# EAGLE schematic smart-tps (EAGLE 9.6.2)
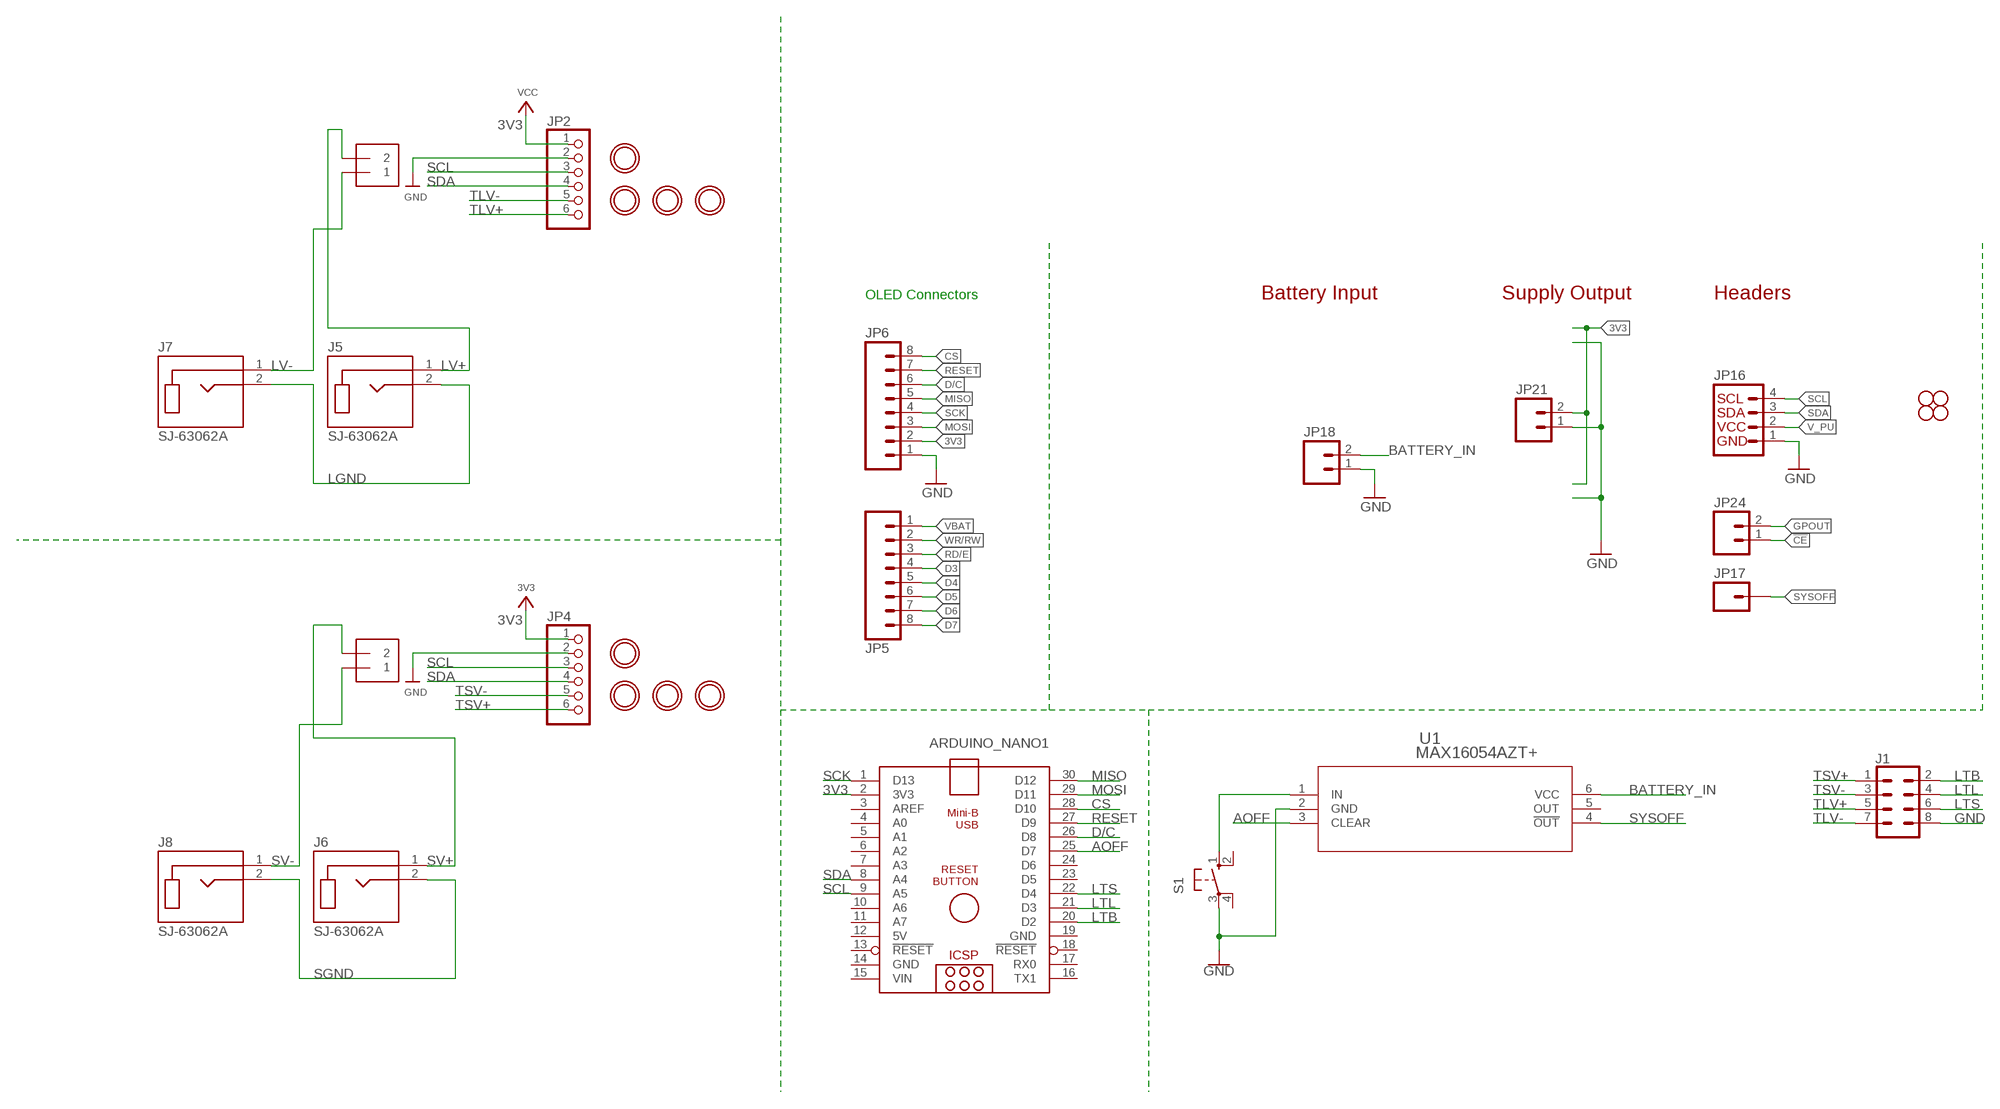
[diagram p0: schematic, sheet 1]

## Parts
ARDUINO_NANO1  ARDUINO_NANO  [ARDUINO_NANO]
J1  CONN_04X2  [2X4]
J2  TERMBLOCK_1X2-3.5MM  [1X2-3.5MM]
J4  TERMBLOCK_1X2-3.5MM  [1X2-3.5MM]
J5  SJ-63062A  [CUI_SJ-63062A]
J6  SJ-63062A  [CUI_SJ-63062A]
J7  SJ-63062A  [CUI_SJ-63062A]
J8  SJ-63062A  [CUI_SJ-63062A]
JP2  HEADER-1X670MIL  [1X06_ROUND_70]
JP4  HEADER-1X670MIL  [1X06_ROUND_70]
JP5  M08  [1X08_PIN1_NO_SILK]
JP6  M08  [1X08_PIN1_NO_SILK]
JP16  I2C_STANDARD_NO_SILK  [1X04_NO_SILK]
JP17  M01PTH_NO_SILK_YES_STOP  [1X01_NO_SILK]
JP18  M021X02_NO_SILK  [1X02_NO_SILK@1]
JP21  M021X02_NO_SILK  [1X02_NO_SILK@1]
JP24  M021X02_NO_SILK  [1X02_NO_SILK@1]
S1  10-XX  [B3F-10XX]
STANDOFF5  STAND-OFF  [STAND-OFF]
STANDOFF6  STAND-OFF  [STAND-OFF]
STANDOFF7  STAND-OFF  [STAND-OFF]
STANDOFF8  STAND-OFF  [STAND-OFF]
U1  MAX16054AZT+  [21-0114C_MXM]
U$18  MOUNTINGHOLE2.5  [MOUNTINGHOLE_2.5_PLATED]
U$19  MOUNTINGHOLE2.5  [MOUNTINGHOLE_2.5_PLATED]
U$20  MOUNTINGHOLE2.5  [MOUNTINGHOLE_2.5_PLATED]
U$21  MOUNTINGHOLE2.5  [MOUNTINGHOLE_2.5_PLATED]
U$40  MOUNTINGHOLE2.5  [MOUNTINGHOLE_2.5_PLATED]
U$41  MOUNTINGHOLE2.5  [MOUNTINGHOLE_2.5_PLATED]
U$42  MOUNTINGHOLE2.5  [MOUNTINGHOLE_2.5_PLATED]
U$43  MOUNTINGHOLE2.5  [MOUNTINGHOLE_2.5_PLATED]

## Nets
3V3 [power_supply]: ARDUINO_NANO1.2(3V3) JP2.1 JP4.1 JP6.2 JP21.2 ; supply symbol labelled VCC
!CE!: JP24.1
AOFF: ARDUINO_NANO1.25(D7) U1.3(CLEAR)
BATTERY_IN: JP18.2 U1.6(VCC)
CS: ARDUINO_NANO1.28(D10) JP6.8
D3: JP5.4
D4: JP5.5
D5: JP5.6
D6: JP5.7
D7: JP5.8
D/C: ARDUINO_NANO1.26(D8) JP6.6
GND: J1.8 JP2.2 JP4.2 JP6.1 JP16.1 JP18.1 JP21.1 S1.3(P) U1.2(GND)
GPOUT: JP24.2
LGND [tool_power]: J5.2(TIP) J7.2(TIP)
LTB: ARDUINO_NANO1.20(D2) J1.2
LTL: ARDUINO_NANO1.21(D3) J1.4
LTS: ARDUINO_NANO1.22(D4) J1.6
LV+ [tool_power]: J2.2 J5.1(SLEEVE)
LV- [tool_power]: J2.1 J7.1(SLEEVE)
MISO: ARDUINO_NANO1.30(D12) JP6.5
MOSI: ARDUINO_NANO1.29(D11) JP6.3
N$4: S1.1(S) U1.1(IN)
RD/E: JP5.3
RESET: ARDUINO_NANO1.27(D9) JP6.7
SCK: ARDUINO_NANO1.1(D13) JP6.4
SCL: ARDUINO_NANO1.9(A5) JP2.3 JP4.3 JP16.4
SDA: ARDUINO_NANO1.8(A4) JP2.4 JP4.4 JP16.3
SGND [tool_power]: J6.2(TIP) J8.2(TIP)
SV+ [tool_power]: J4.2 J6.1(SLEEVE)
SV- [tool_power]: J4.1 J8.1(SLEEVE)
SYSOFF: JP17.1 U1.4(!OUT)
TLV+: J1.5 JP2.6
TLV-: J1.7 JP2.5
TSV+: J1.1 JP4.6
TSV-: J1.3 JP4.5
V_PU: JP16.2
VBAT: JP5.1
WR/RW: JP5.2
Unconnected: ARDUINO_NANO1.3(AREF) ARDUINO_NANO1.4(A0) ARDUINO_NANO1.5(A1) ARDUINO_NANO1.6(A2) ARDUINO_NANO1.7(A3) ARDUINO_NANO1.10(A6) ARDUINO_NANO1.11(A7) ARDUINO_NANO1.13(!RESET) ARDUINO_NANO1.16(TX1) ARDUINO_NANO1.17(RX0) ARDUINO_NANO1.18(!RESET) ARDUINO_NANO1.23(D5) ARDUINO_NANO1.24(D6) S1.2(S1) S1.4(P1) U1.5(OUT)

## Notes on the sheet
- Battery Input | Supply Output | Headers
- OLED Connectors

## Power pins joined to a net without a drawn wire
5V: ARDUINO_NANO1.12(5V)
GND: ARDUINO_NANO1.14(GND) ARDUINO_NANO1.19(GND)
VIN: ARDUINO_NANO1.15(VIN)

## Library data of the parts
ARDUINO_NANO1 = ArduinoNanoV30:ARDUINO_NANO: Arduino Nano V3.0 Overview: The Arduino Nano is a small, complete, and breadboard-friendly board based on the ATmega328 (Arduino Nano 3.x) or ATmega168 (Arduino Nano 2.x). It has more or less the same functionality of the Arduino Duemilanove, but in a different package. It lacks only a DC power jack, and works with a Mini-B USB cable instead of a standard one. The Nano was designed and is being produced by Gravitech. Specifications: Microcontroller Atmel ATmega168 or ATmega328 Operating Voltage (logic level) 5 V Input Voltage (recommended) 7-12 V Input Voltage (limits) 6-20 V Digital I/O Pins 14 (of which 6 provide PWM output) Analog Input Pins 8 DC Current per I/O Pin 40 mA Flash Memory 16 KB (ATmega168) or 32 KB (ATmega328) of which 2 KB used by bootloader SRAM 1 KB (ATmega168) or 2 KB (ATmega328) EEPROM 512 bytes (ATmega168) or 1 KB (ATmega328) Clock Speed 16 MHz Dimensions 0.73" x 1.70" Length 45 mm Width 18 mm Weigth 5 g Power: The Arduino Nano can be powered via the Mini-B USB connection, 6-20V unregulated external power supply (pin 30), or 5V regulated external power supply (pin 27). The power source is automatically selected to the highest voltage source. Memory: The ATmega168 has 16 KB of flash memory for storing code (of which 2 KB is used for the bootloader); the ATmega328 has 32 KB, (also with 2 KB used for the bootloader). The ATmega168 has 1 KB of SRAM and 512 bytes of EEPROM (which can be read and written with the EEPROM library); the ATmega328 has 2 KB of SRAM and 1 KB of EEPROM. Input and Output: Each of the 14 digital pins on the Nano can be used as an input or output, using pinMode(), digitalWrite(), and digitalRead() functions. They operate at 5 volts. Each pin can provide or receive a maximum of 40 mA and has an internal pull-up resistor (disconnected by default) of 20-50 kOhms. In addition, some pins have specialized functions. Visit Arduino - ArduinoBoardNano <https://www.arduino.cc/en/Main/ArduinoBoardNano>
J1 = SparkFun-Connectors:CONN_04X2: Multi connection point. Often used as Generic Header-pin footprint for 0.1 inch spaced/style header connections On any of the 0.1 inch spaced packages, you can populate with these: Break Away Headers - Straight <https://www.sparkfun.com/products/116> (PRT-00116) Break Away Male Headers - Right Angle <https://www.sparkfun.com/products/553> (PRT-00553) Female Headers <https://www.sparkfun.com/products/115> (PRT-00115) Break Away Headers - Machine Pin <https://www.sparkfun.com/products/117> (PRT-00117) Break Away Female Headers - Swiss Machine Pin <https://www.sparkfun.com/products/743> (PRT-00743)
J2 J4 = microbuilder:TERMBLOCK_1X2: 3.5mm Terminal block http://www.ladyada.net/library/pcb/eaglelibrary.html
J5-J8 = SJ-63062A:SJ-63062A; CUI_PURCHASE_URL: https://www.cuidevices.com/product/interconnect/connectors/audio-connectors/jacks/sj-6306-series?utm_source=snapeda.com&utm_medium=referral&utm_campaign=snapedaBOM; DESCRIPTION: 6.35 mm, Mono and Stereo, Right Angle, Through Hole, 2~3 Conductors, 0~1 Internal Switches, Audio Jack Connector; DIGI-KEY_PART_NUMBER: 2223-SJ-63062A-ND; MF: CUI Devices; MP: SJ-63062A; PACKAGE: Package; PURCHASE-URL: https://pricing.snapeda.com/search/part/SJ-63062A/?ref=eda
JP2 JP4 = microbuilder:HEADER-1X6: PIN HEADER
JP5 JP6 = SparkFun-Connectors:M08: Header 8 Standard 8-pin 0.1" header. Use with straight break away headers (SKU : PRT-00116), right angle break away headers (PRT-00553), swiss pins (PRT-00743), machine pins (PRT-00117), and female headers (PRT-00115).
JP16 = SparkFun-Connectors:I2C_STANDARD: SparkFun has standardized on a pinout for all I2C based sensor breakouts. This pinout allows I2C boards to be plugged directly into the headers on Arduino Uno compatible boards, and to be daisy chained easily.
JP17 = SparkFun-Connectors:M01: Header 1 Standard 1-pin 0.1" header. Use with straight break away headers (SKU : PRT-00116), right angle break away headers (PRT-00553), swiss pins (PRT-00743), machine pins (PRT-00117), and female headers (PRT-00115).
JP18 JP21 JP24 = SparkFun-Connectors:M02: Standard 2-pin 0.1" header. Use with - straight break away headers ( PRT-00116) - right angle break away headers (PRT-00553) - swiss pins (PRT-00743) - machine pins (PRT-00117) - female headers (PRT-00115) Molex polarized connector foot print use with: PRT-08233 with associated crimp pins and housings. 2.54_SCREWTERM for use with PRT-10571. 3.5mm Screw Terminal footprints for PRT-08084 5mm Screw Terminal footprints for use with PRT-08432
S1 = switch-omron:10-XX: OMRON SWITCH; MPN: B3F-1000; OC_FARNELL: 176432; OC_NEWARK: 36M3542
STANDOFF5-STANDOFF8 = SparkFun-Electromechanical:STAND-OFF: #4 Stand Off This is the mechanical footprint for a #4 phillips button head screw. Use the keepout ring to avoid running the screw head into surrounding components. SKU : PRT-00447
U1 = MAX16054AZT:MAX16054AZT+; BUILT_BY: EMA_UL_Team; MANUFACTURER_PART_NUMBER: MAX16054AZT+; REVISION: 1; SOURCELIBRARY: Maxim_2014-05-21; VENDOR: Maxim Integrated Products
U$18-U$21 U$40-U$43 = microbuilder:MOUNTINGHOLE: Mounting Hole For #2 screws (0.086"/2.18mm width, 0.094"/2.4mm hole) use 2.5mm

## Net classes
0 default: width 0.61 mm, clearance 0.305 mm
1 tool_power: width 1.524 mm, drill 0.356 mm, clearance 0.762 mm
2 power_supply: width 0.762 mm, clearance 0.305 mm
3 12_mil: width 0.305 mm